# EAGLE design PET_Joystick_Adapter (EAGLE 9.6.0)
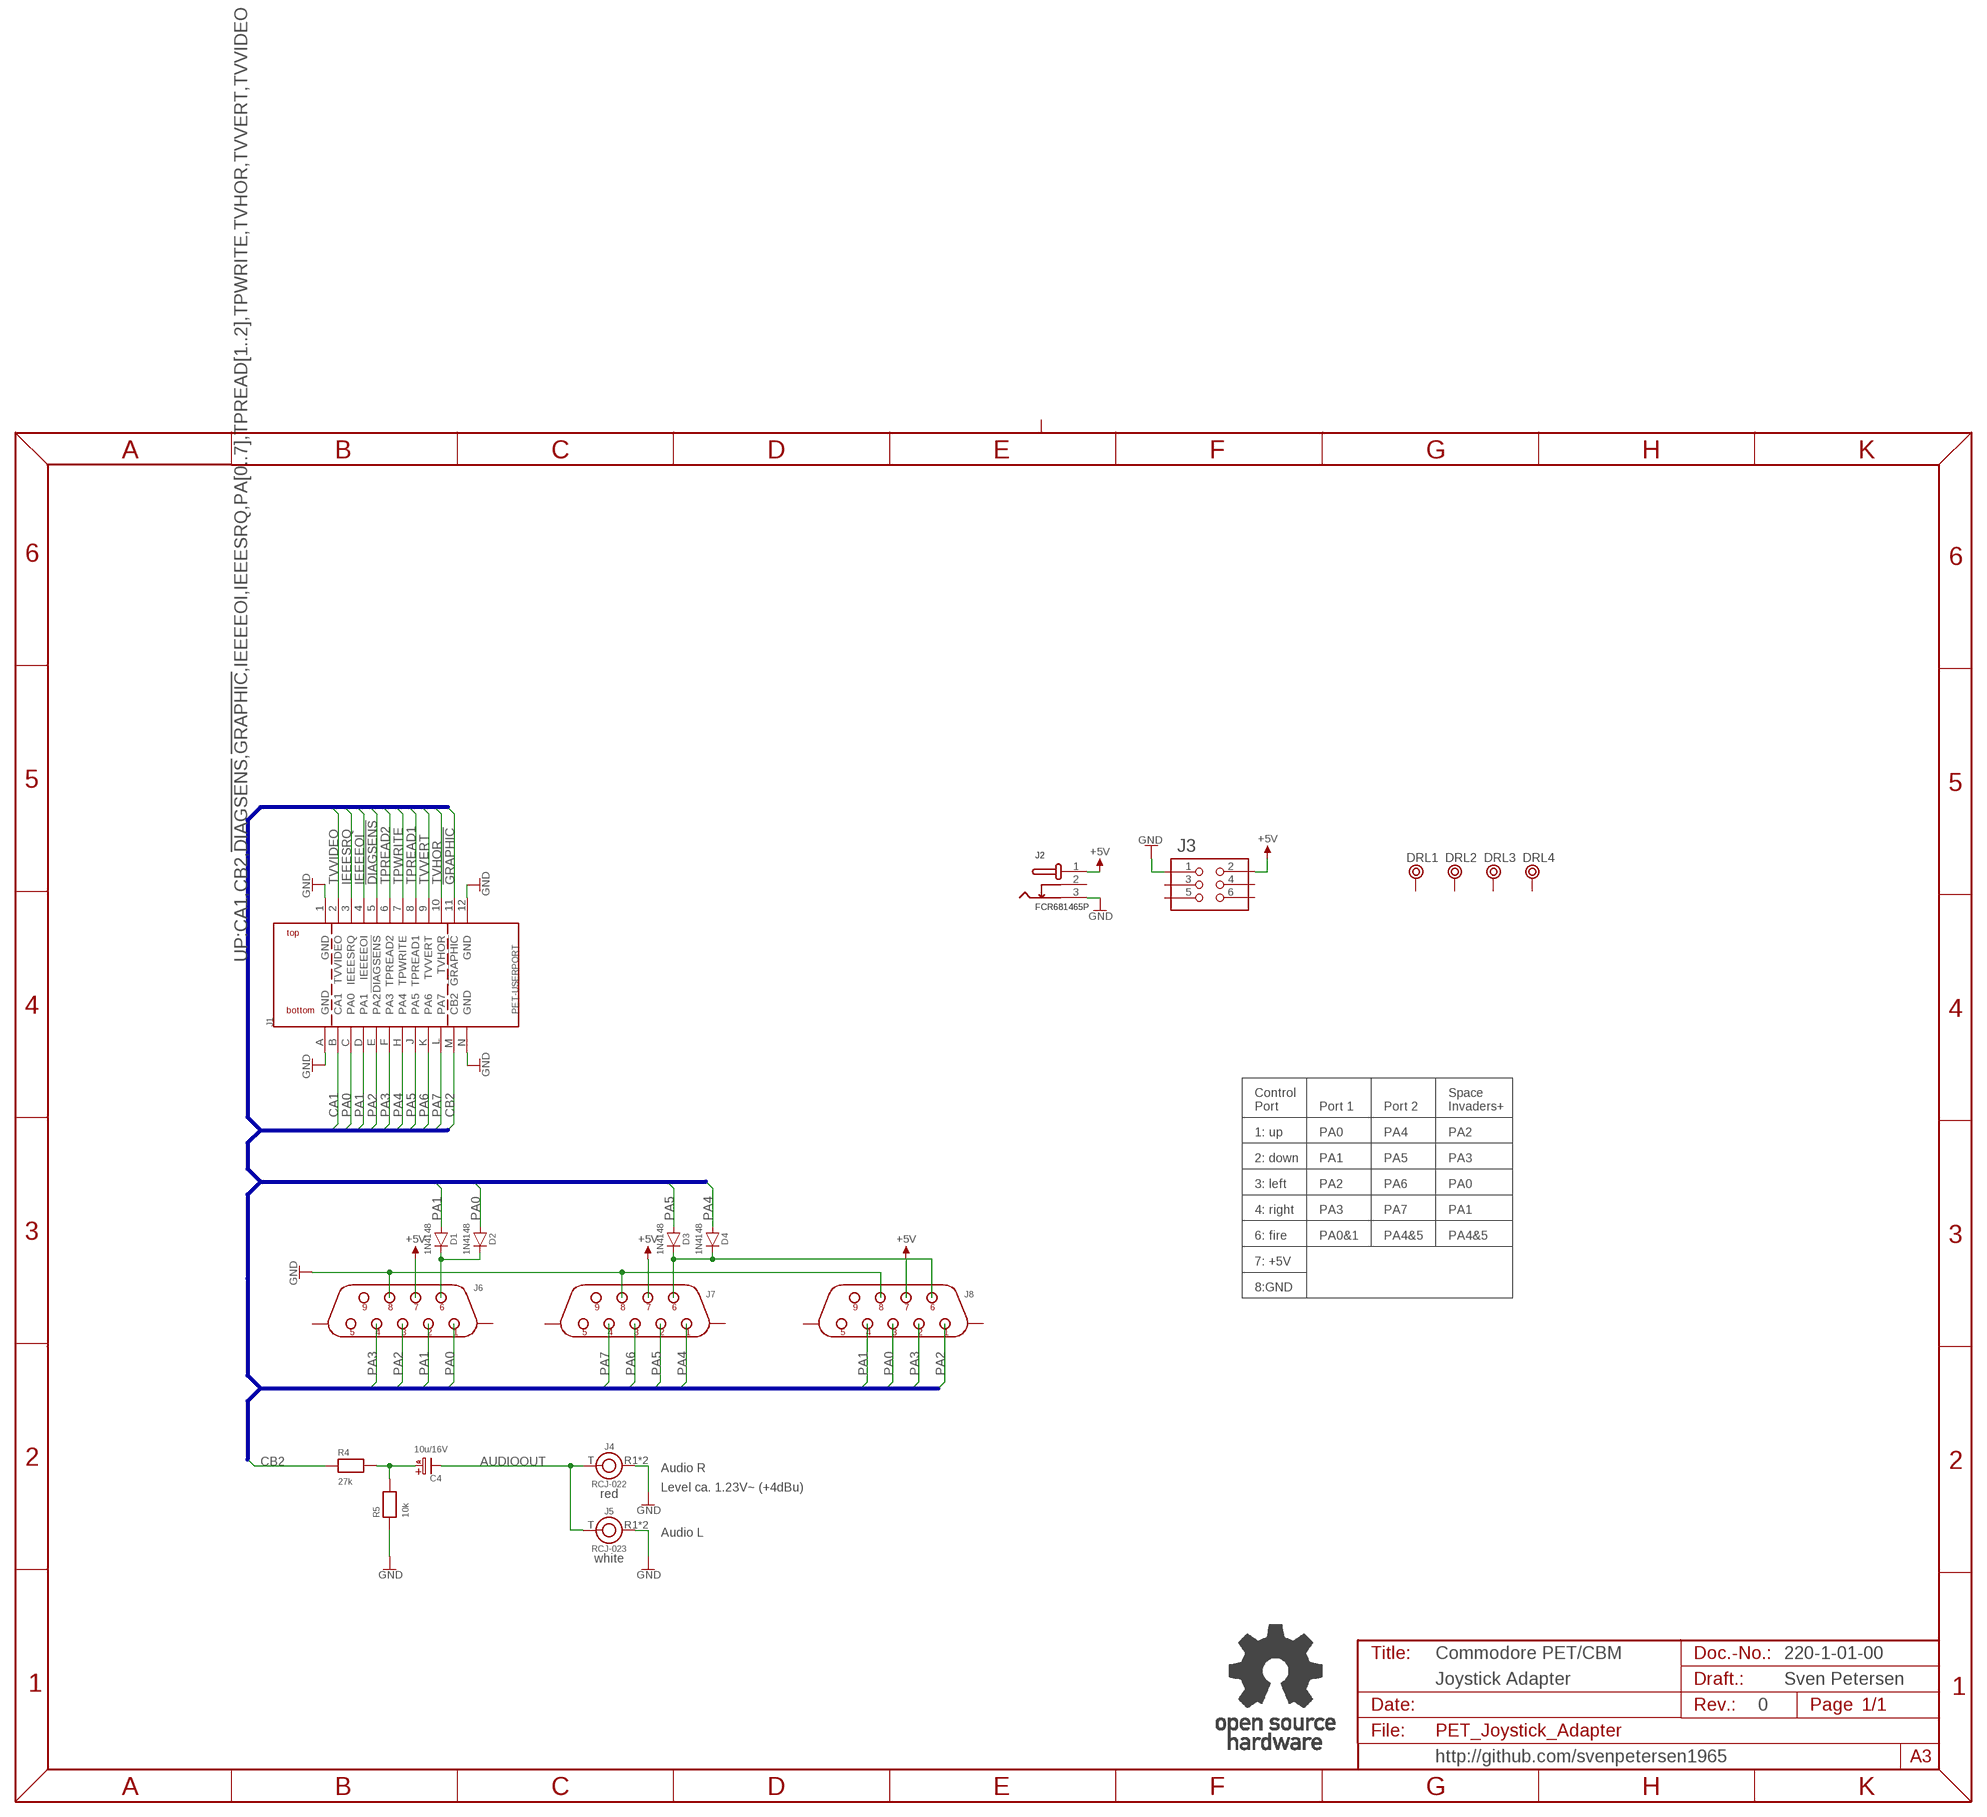
[diagram p0: schematic, sheet 1]

## Parts
C4  10u/16V  C05,0/2,0  [C5,0/2,0]
D1  1N4148  1N41480.3"  [DO-35/3]
D2  1N4148  1N41480.3"  [DO-35/3]
D3  1N4148  1N41480.3"  [DO-35/3]
D4  1N4148  1N41480.3"  [DO-35/3]
DRL1  BOHR3,5  [BOHR3,5]
DRL2  BOHR3,5  [BOHR3,5]
DRL3  BOHR3,5  [BOHR3,5]
DRL4  BOHR3,5  [BOHR3,5]
J1  PET-USERPORT  [USERPORT]
J2  FCR681465P  [FCR681465P]
J3  2X03WV  [2X03WV]
J4  RCJ-022  RCJ-02X  [RCJ-02X]
J5  RCJ-023  RCJ-02X  [RCJ-02X]
J6  DS09M-H-CL  [DS9M-H]
J7  DS09M-H-CL  [DS9M-H]
J8  DS09M-V-CL  [DS09M-V]
R4  27k  RES04  [R-10]
R5  10k  RES04  [R-10]
U$2  OPEN_SOURCE_HW  [OPENHW]

## Nets
!DIAGSENS: J1.5(!DIAGSENS)
!GRAPHIC: J1.11(!GRAPHIC)
+5V: J2.1 J3.2 J6.7 J7.7 J8.7
AUDIOOUT: C4.K(-) J4.T J5.T
CA1: J1.B(CA1)
CB2: J1.M(CB2) R4.1
GND: J1.1(GND) J1.12(GND) J1.A(GND) J1.N(GND) J2.3 J3.1 J4.R1(R) J4.R2(R) J5.R1(R) J5.R2(R) J6.8 J7.8 J8.8 R5.1
IEEEEOI: J1.4(IEEEEOI)
IEEESRQ: J1.3(IEEESRQ)
N$1: C4.A(+) R4.2 R5.2
N$2: D1.K D2.K J6.6
N$3: D3.K D4.K J7.6 J8.6
PA0: D2.A J1.C(PA0) J6.1 J8.3
PA1: D1.A J1.D(PA1) J6.2 J8.4
PA2: J1.E(PA2) J6.3 J8.1
PA3: J1.F(PA3) J6.4 J8.2
PA4: D4.A J1.H(PA4) J7.1
PA5: D3.A J1.J(PA5) J7.2
PA6: J1.K(PA6) J7.3
PA7: J1.L(PA7) J7.4
TPREAD1: J1.8(TPREAD1)
TPREAD2: J1.6(TPREAD2)
TPWRITE: J1.7(TPWRITE)
TVHOR: J1.10(TVHOR)
TVVERT: J1.9(TVVERT)
TVVIDEO: J1.2(TVVIDEO)
Unconnected: DRL1.P$1 DRL2.P$1 DRL3.P$1 DRL4.P$1 J2.2 J3.3 J3.4 J3.5 J3.6 J6.5 J6.9 J6.PE1 J6.PE2 J7.5 J7.9 J7.PE1 J7.PE2 J8.5 J8.9 J8.PE1 J8.PE2

## Buses
UP:CA1,CB2,!DIAGSENS,!GRAPHIC,IEEEEOI,IEEESRQ,PA[0..7],TPREAD[1..2],TPWRITE,TVHOR,TVVERT,TVVIDEO

## Notes on the sheet
- Control
  Port
- Port 1 | Port 2
- Space
  Invaders+
- 1: up | PA0 | PA4 | PA2
- 2: down | PA1 | PA5 | PA3
- 3: left | PA2 | PA6 | PA0
- 4: right | PA3 | PA7 | PA1
- 6: fire | PA0&1 | PA4&5 | PA4&5
- 7: +5V
- 8:GND
- Audio R
- Level ca. 1.23V~ (+4dBu)
- red
- Audio L
- white
- Commodore PET/CBM | 220-1-01-00
- Joystick Adapter | Sven Petersen
- 0
- http://github.com/svenpetersen1965

## Library data of the parts
C4 = ELCO:C05,0/2,0
D1-D4 = Dioden:1N4148
DRL1-DRL4 = Mech_Bohr:BOHR3,5
J1 = Commodore:PET-USERPORT
J2 = Cliff:FCR681465P
J3 = PINHEAD:2X03WV
J4 J5 = CUI_INC:RCJ-02X
J6 J7 = Connec:DS09M-H-CL
J8 = Connec:DS09M-V-CL
R4 R5 = DISCRETE:RES04
U$2 = Logo:OPEN_SOURCE_HW

## Board
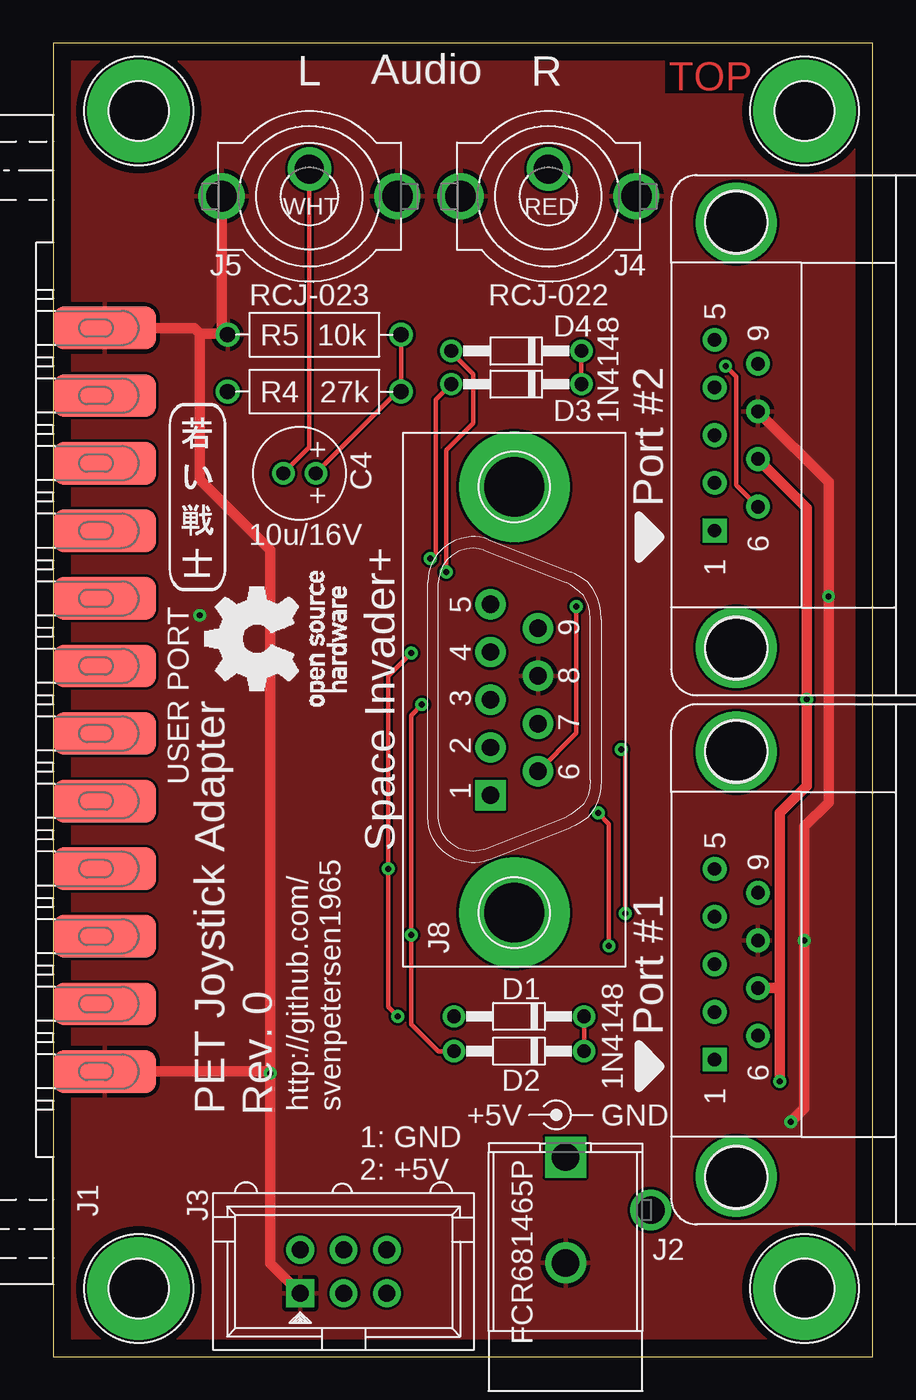
[diagram p1: board, top side]
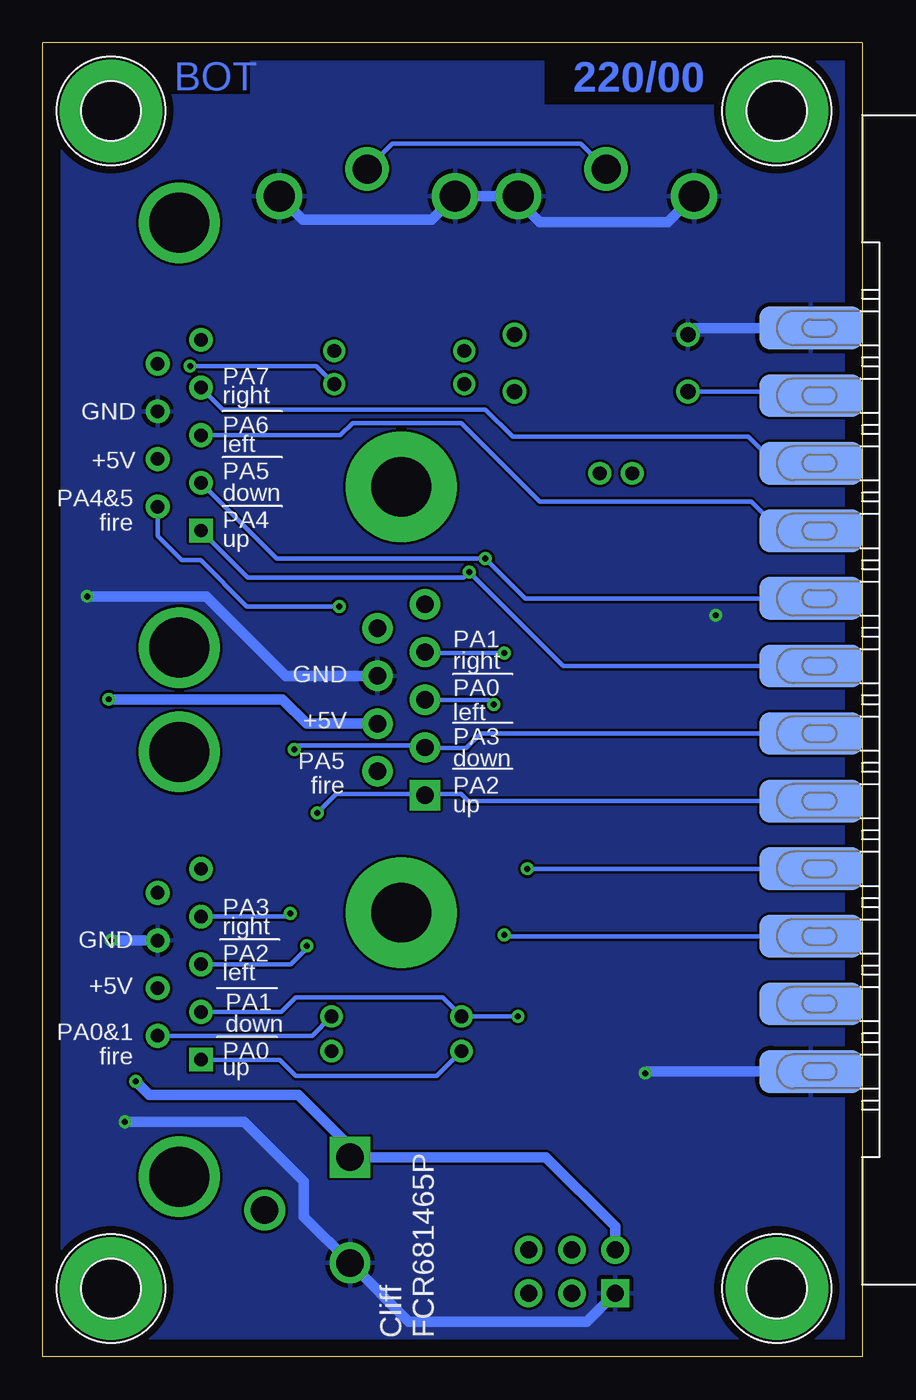
[diagram p2: board, bottom side, seen from below]

Size 48 x 77 mm. Coordinates in mm from the lower left corner, seen from the top.
Outline: 0,0 48,0 48,77 0,77 0,0
Copper layers (1*16): Top 0.035mm / dielectric 1.5mm / Bottom 0.035mm
Design rules "default *": minimum track width 6mil, minimum drill 0.35mm, track to track 6mil, track to pad 6mil, pad to pad 6mil, via to via 6mil, smd to smd 6mil, copper to edge 40mil, drill to drill 6mil, minimum pad ring 10mil, minimum via ring 8mil, stop-mask expansion 4mil, vias tented up to drill 25mil, thermal gap 10mil
bRestrict: 2 lines

### Footprints (pad centres in the part's own frame; a part is rotated, then mirrored left to right if it is on the bottom)
C5,0/2,0 = drill 0.813 pad 1.27: A -0.953,0; K 0.953,0
DO-35/3 = drill 0.8: A -3.81,0; K 3.81,0
BOHR3,5 = drill 3.5 pad 6: P$1 0,0
USERPORT = smd 2.5 x 6: 1 -21.78,-3; 2 -17.82,-3; 3 -13.86,-3; 4 -9.9,-3; 5 -5.94,-3; 6 -1.98,-3; 7 1.98,-3; 8 5.94,-3; 9 9.9,-3; 10 13.86,-3; 11 17.82,-3; 12 21.78,-3 | smd 2.5 x 6 bottom: A -21.78,-3; B -17.82,-3; C -13.86,-3; D -9.9,-3; E -5.94,-3; F -1.98,-3; H 1.98,-3; J 5.94,-3; K 9.9,-3; L 13.86,-3; M 17.82,-3; N 21.78,-3
FCR681465P = drill 1.6 square: 1 0,13.7 | drill 1.6: 2 5,10.6; 3 0,7.5
2X03WV = drill 1 pad 1.626 square: 1 -2.54,-1.27 | drill 1 pad 1.626: 2 -2.54,1.27; 3 0,-1.27; 4 0,1.27; 5 2.54,-1.27; 6 2.54,1.27
RCJ-02X = drill 1.8 pad 2.54: R1 -5.15,0; R2 5.15,0 | drill 1.7 pad 2.5: T 0,1.6
DS9M-H = drill 0.787 pad 1.397 square: 1 5.588,-1.27 | drill 0.787 pad 1.397: 2 2.794,-1.27; 3 0,-1.27; 4 -2.794,-1.27; 5 -5.588,-1.27; 6 4.191,1.27; 7 1.397,1.27; 8 -1.397,1.27; 9 -4.191,1.27 | drill 3.505 pad 4.724: PE1 -12.446,0; PE2 12.446,0
DS09M-V = drill 1.016 pad 1.778 square: 1 -5.588,1.397 | drill 1.016 pad 1.778: 2 -2.794,1.397; 3 0,1.397; 4 2.794,1.397; 5 5.588,1.397; 6 -4.191,-1.397; 7 -1.397,-1.397; 8 1.397,-1.397; 9 4.191,-1.397 | drill 3.505 pad 6.477: PE1 -12.478,0; PE2 12.478,0
R-10 = drill 0.889 pad 1.397: 1 -5.08,0; 2 5.08,0

### Placement (x,y rotation side)
C4  14.42,51.77 180 top
D1  27.27,19.94 0 top
D2  27.27,17.91 0 top
D3  27.12,57 0 top
D4  27.12,58.94 0 top
DRL1  5,4 0 top
DRL2  44,4 0 top
DRL3  44,73 0 top
DRL4  5,73 0 top
J1  0,38.5 90 top
J2  30,-2 0 top
J3  17,5 0 top
J4  29,68 0 top
J5  15,68 0 top
J6  40,23 270 top
J7  40,54 270 top
J8  27,38.5 90 top
R4  15.29,56.55 0 top
R5  15.29,59.89 0 top
U$2  17.14,38.13 90 top
U$11  [2LAYER]  36.04,74.2 0 top
U$22  [PCB-TITLE/]  -0.08,92.44 0 top  (outside the outline)
U$26  [SVEN_TAG]  8.48,50.49 0 top

### Tracks (layer width: path | path; a pad name or v marks a point on that pad's centre or on a via)
+5V  (via drill 0.35)
  Top 0.61: v42.55,16.14 42.55,21.54 | 42.55,21.54 42.55,31.86 44.13,33.45 v44.13,38.53 44.13,49.74 J7.7 | J6.7 42.55,21.6 42.55,21.54
  Bottom 0.61: J3.2 14.46,7.63 18.53,11.7 J2.1 30.16,11.86 30.16,12.49 33.02,15.35 41.75,15.35 v42.55,16.14 | J8.7 32.55,37.1 33.97,38.53 v44.13,38.53
AUDIOOUT
  Top 0.254: C4.K 15,53.3 J5.T
  Bottom 0.254: J5.T 16.47,71.07 27.53,71.07 J4.T
CB2
  Bottom 0.254: J1.M 3.23,56.55 R4.1
GND  (via drill 0.35)
  Top 0.61: v43.18,13.76 43.97,14.56 v43.97,24.4 43.97,31.07 45.4,32.5 v45.4,44.56 45.4,51.26 J7.8 | J3.1 12.7,5.49 v12.7,16.62 | v12.7,16.62 12.6,16.72 J1.A | v12.7,16.62 12.7,47.26 8.57,51.39 8.57,59.96 | 8.57,59.96 8.25,60.28 J1.N | 8.57,59.96 10.13,59.96 R5.1 9.85,60.24 J5.R1
  Bottom 0.61: J3.1 16.13,2.06 26.56,2.06 J2.3 32.7,8.2 32.7,10.27 36.2,13.76 v43.18,13.76 | v43.97,24.4 J6.8 | J1.A 12.6,16.72 v12.7,16.62 | J8.8 33.75,39.9 38.42,44.56 v45.4,44.56 | J1.N 9.81,60.28 R5.1 | J5.R1 11.38,66.47 18.89,66.47 20.15,67.73 J5.R2 J4.R1 25.22,66.63 32.78,66.63 J4.R2
  other vias: 8.57,43.45
  pour Top: 0.79,76.26 47.47,76.26 47.47,0.64 0.79,0.64
  pour Bottom: 0.79,76.26 47.47,76.26 47.47,0.64 0.79,0.64
N$1
  Top 0.254: C4.A 20.16,56.55 R4.2 R5.2
N$2
  Top 0.254: D2.K D1.K
  Bottom 0.254: J6.6 32.22,18.81 D1.K
N$3  (via drill 0.35)
  Top 0.254: J7.6 40.01,51.07 40.01,57.42 v39.37,58.05 | D3.K D4.K | J8.6 30.64,36.55 v30.64,43.97
  Bottom 0.254: v39.37,58.05 31.98,58.05 D3.K | v30.64,43.97 36.04,43.97 38.73,46.67 39.85,46.67 41.27,48.1 J7.6
PA0  (via drill 0.35)
  Top 0.254: v21.59,38.21 20.95,37.58 v20.95,24.72 20.95,19.48 22.54,17.89 23.44,17.89 D2.A
  Bottom 0.254: J1.C 20.88,24.64 v20.95,24.72 | v21.59,38.21 21.88,38.5 J8.3 | J6.1 34.13,17.41 33.18,16.46 24.91,16.46 D2.A
PA1  (via drill 0.35)
  Top 0.254: v20.95,41.23 19.61,39.88 v19.61,28.6 19.61,20.5 v20.16,19.95
  Bottom 0.254: J1.D v19.61,28.6 | v20.95,41.23 25.54,41.23 J8.4 | v20.16,19.95 23.45,19.95 | 23.45,19.95 D1.A | J6.2 34.04,20.21 33.18,21.07 24.57,21.07 23.45,19.95
PA2  (via drill 0.35)
  Top 0.254: v32.54,24.08 32.54,31.23 v31.91,31.86
  Bottom 0.254: J1.E 23.08,32.56 23.5,32.97 25.54,32.97 | 25.54,32.97 J8.1 | J6.3 33.47,23 32.46,24 v32.54,24.08 | v31.91,31.86 30.8,32.97 25.54,32.97
PA3  (via drill 0.35)
  Top 0.254: v33.5,25.99 33.5,35.51 33.34,35.67 v33.26,35.59
  Bottom 0.254: J1.F 22.33,36.52 23.18,35.67 25.57,35.67 | 25.57,35.67 J8.2 | J6.4 33.69,25.79 v33.5,25.99 | v33.26,35.59 33.02,35.83 25.73,35.83 25.57,35.67
PA4  (via drill 0.35)
  Top 0.254: D4.A 23.31,58.88 24.61,57.58 24.61,54.72 23.02,53.13 v23.02,45.99
  Bottom 0.254: J1.H 17.51,40.48 v23.02,45.99 23.34,45.67 35.99,45.67 J7.1
PA5  (via drill 0.35)
  Top 0.254: v22.07,46.78 22.38,47.1 22.38,56.08 D3.A
  Bottom 0.254: J1.J 19.72,44.44 v22.07,46.78 34.29,46.78 38.71,51.21 J7.2
PA6
  Bottom 0.254: J7.3 30.57,54 29.84,54.72 23.5,54.72 18.89,50.12 6.51,50.12 5.08,48.69 2.54,48.69 2.83,48.4 J1.K
PA7
  Bottom 0.254: J7.4 37.45,55.52 22.07,55.52 20.48,53.93 6.67,53.93 5.1,52.36 J1.L

### Text on the board
Bottom: 220/00
tPlace: PET Joystick Adapter | Rev. 0 | http://github.com/ / svenpetersen1965 | +5V | GND | 1: GND / 2: +5V
tNames: Audio | L | R | WHT | RED | Port #2 | USER PORT | Space Invader+ | Port #1
bNames: PA7 | right | PA6 | GND | left | +5V | PA5 | down | PA4&5 | PA4 | fire | up | PA1 | right | GND | PA0 | left | +5V | PA3 | down | PA5 | PA2 | fire | up | PA3 | right | PA2 | GND | left | +5V | PA1 | down | PA0&1 | PA0 | fire | up | Cliff / FCR681465P
Document: 220-2-01-00 | Sven Petersen / 2025 | 35µm | 2 | 0